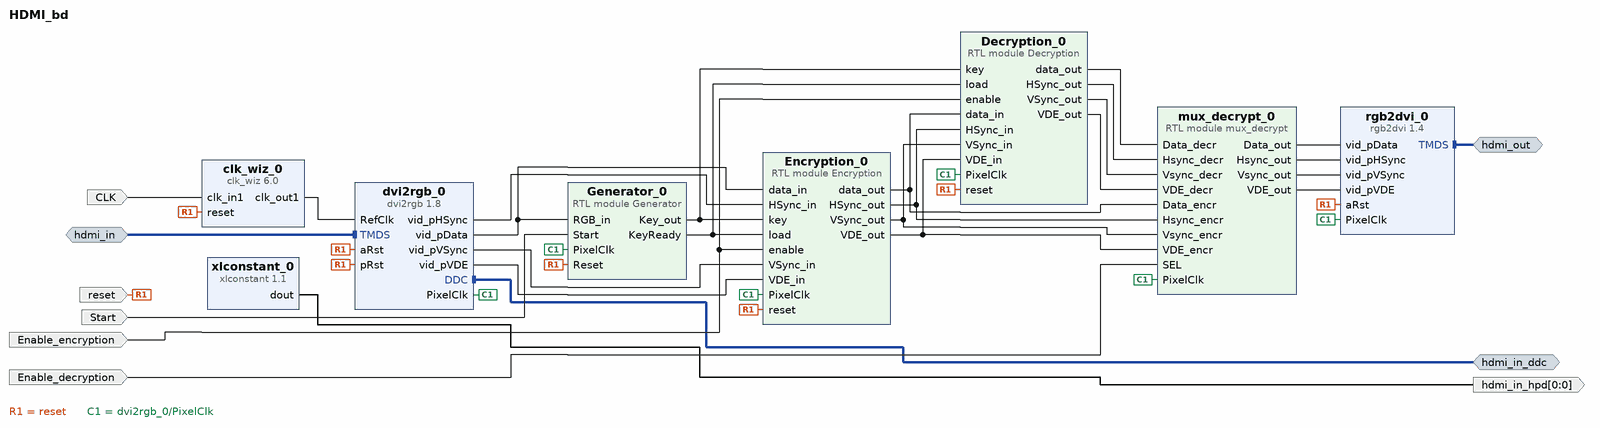
[diagram p0: block diagram of the top level]
# Vivado block design HDMI_bd, xc7z020clg400-1, Vivado 2018.3
create_bd_design HDMI_bd

create_bd_intf_port -mode Slave -vlnv digilentinc.com:interface:tmds_rtl:1.0 hdmi_in
create_bd_intf_port -mode Master -vlnv xilinx.com:interface:iic_rtl:1.0 hdmi_in_ddc
create_bd_intf_port -mode Master -vlnv digilentinc.com:interface:tmds_rtl:1.0 hdmi_out
create_bd_port -dir I -type clk CLK
set_property -dict {CONFIG.FREQ_HZ 125000000} [get_bd_ports CLK]
create_bd_port -dir I -type rst reset
set_property -dict {CONFIG.POLARITY ACTIVE_HIGH} [get_bd_ports reset]
create_bd_port -dir O -from 0 -to 0 hdmi_in_hpd
create_bd_port -dir I Start
create_bd_port -dir I Enable_encryption
create_bd_port -dir I Enable_decryption

create_bd_cell -type ip -vlnv digilentinc.com:ip:dvi2rgb:1.8 dvi2rgb_0
create_bd_cell -type ip -vlnv digilentinc.com:ip:rgb2dvi:1.4 rgb2dvi_0
set_property -dict {CONFIG.kClkPrimitive MMCM CONFIG.kClkRange 3} [get_bd_cells rgb2dvi_0]
create_bd_cell -type ip -vlnv xilinx.com:ip:clk_wiz:6.0 clk_wiz_0
set_property -dict [list \
  CONFIG.CLKIN1_JITTER_PS 80.0 \
  CONFIG.CLKOUT1_DRIVES BUFG \
  CONFIG.CLKOUT1_JITTER 109.241 \
  CONFIG.CLKOUT1_PHASE_ERROR 96.948 \
  CONFIG.CLKOUT1_REQUESTED_OUT_FREQ 200.000 \
  CONFIG.CLKOUT2_DRIVES BUFG \
  CONFIG.CLKOUT3_DRIVES BUFG \
  CONFIG.CLKOUT4_DRIVES BUFG \
  CONFIG.CLKOUT5_DRIVES BUFG \
  CONFIG.CLKOUT6_DRIVES BUFG \
  CONFIG.CLKOUT7_DRIVES BUFG \
  CONFIG.MMCM_CLKFBOUT_MULT_F 8 \
  CONFIG.MMCM_CLKIN1_PERIOD 8.000 \
  CONFIG.MMCM_CLKIN2_PERIOD 10.0 \
  CONFIG.MMCM_CLKOUT0_DIVIDE_F 5 \
  CONFIG.MMCM_COMPENSATION ZHOLD \
  CONFIG.MMCM_DIVCLK_DIVIDE 1 \
  CONFIG.PRIMITIVE PLL \
  CONFIG.PRIM_IN_FREQ 125.000 \
] [get_bd_cells clk_wiz_0]
create_bd_cell -type ip -vlnv xilinx.com:ip:xlconstant:1.1 xlconstant_0
create_bd_cell -type module -reference Generator Generator_0
create_bd_cell -type module -reference Encryption Encryption_0
create_bd_cell -type module -reference mux_decrypt mux_decrypt_0
create_bd_cell -type module -reference Decryption Decryption_0

# ---- connections ----

connect_bd_intf_net [get_bd_intf_ports hdmi_in] [get_bd_intf_pins dvi2rgb_0/TMDS]
connect_bd_intf_net [get_bd_intf_ports hdmi_out] [get_bd_intf_pins rgb2dvi_0/TMDS]
connect_bd_intf_net [get_bd_intf_ports hdmi_in_ddc] [get_bd_intf_pins dvi2rgb_0/DDC]
connect_bd_net [get_bd_ports CLK] [get_bd_pins clk_wiz_0/clk_in1]
connect_bd_net [get_bd_ports reset] \
  [get_bd_pins dvi2rgb_0/aRst] [get_bd_pins dvi2rgb_0/pRst] [get_bd_pins rgb2dvi_0/aRst] [get_bd_pins clk_wiz_0/reset] \
  [get_bd_pins Generator_0/Reset] [get_bd_pins Encryption_0/reset] [get_bd_pins Decryption_0/reset]
connect_bd_net [get_bd_pins clk_wiz_0/clk_out1] [get_bd_pins dvi2rgb_0/RefClk]
connect_bd_net [get_bd_pins dvi2rgb_0/PixelClk] \
  [get_bd_pins rgb2dvi_0/PixelClk] [get_bd_pins Generator_0/PixelClk] [get_bd_pins Encryption_0/PixelClk] \
  [get_bd_pins mux_decrypt_0/PixelClk] [get_bd_pins Decryption_0/PixelClk]
connect_bd_net [get_bd_pins xlconstant_0/dout] [get_bd_ports hdmi_in_hpd]
connect_bd_net [get_bd_pins Generator_0/Key_out] [get_bd_pins Encryption_0/key] [get_bd_pins Decryption_0/key]
connect_bd_net [get_bd_pins Generator_0/KeyReady] [get_bd_pins Encryption_0/load] [get_bd_pins Decryption_0/load]
connect_bd_net [get_bd_ports Start] [get_bd_pins Generator_0/Start]
connect_bd_net [get_bd_ports Enable_encryption] [get_bd_pins Encryption_0/enable] [get_bd_pins Decryption_0/enable]
connect_bd_net [get_bd_pins dvi2rgb_0/vid_pData] [get_bd_pins Generator_0/RGB_in] [get_bd_pins Encryption_0/data_in]
connect_bd_net [get_bd_pins dvi2rgb_0/vid_pHSync] [get_bd_pins Encryption_0/HSync_in]
connect_bd_net [get_bd_pins dvi2rgb_0/vid_pVSync] [get_bd_pins Encryption_0/VSync_in]
connect_bd_net [get_bd_pins dvi2rgb_0/vid_pVDE] [get_bd_pins Encryption_0/VDE_in]
connect_bd_net [get_bd_pins Decryption_0/data_out] [get_bd_pins mux_decrypt_0/Data_decr]
connect_bd_net [get_bd_pins Decryption_0/HSync_out] [get_bd_pins mux_decrypt_0/Hsync_decr]
connect_bd_net [get_bd_pins Decryption_0/VSync_out] [get_bd_pins mux_decrypt_0/Vsync_decr]
connect_bd_net [get_bd_pins Decryption_0/VDE_out] [get_bd_pins mux_decrypt_0/VDE_decr]
connect_bd_net [get_bd_pins Encryption_0/data_out] [get_bd_pins mux_decrypt_0/Data_encr] [get_bd_pins Decryption_0/data_in]
connect_bd_net [get_bd_pins Encryption_0/HSync_out] [get_bd_pins mux_decrypt_0/Hsync_encr] [get_bd_pins Decryption_0/HSync_in]
connect_bd_net [get_bd_pins Encryption_0/VSync_out] [get_bd_pins mux_decrypt_0/Vsync_encr] [get_bd_pins Decryption_0/VSync_in]
connect_bd_net [get_bd_pins Encryption_0/VDE_out] [get_bd_pins mux_decrypt_0/VDE_encr] [get_bd_pins Decryption_0/VDE_in]
connect_bd_net [get_bd_pins mux_decrypt_0/Data_out] [get_bd_pins rgb2dvi_0/vid_pData]
connect_bd_net [get_bd_pins mux_decrypt_0/Hsync_out] [get_bd_pins rgb2dvi_0/vid_pHSync]
connect_bd_net [get_bd_pins mux_decrypt_0/Vsync_out] [get_bd_pins rgb2dvi_0/vid_pVSync]
connect_bd_net [get_bd_pins mux_decrypt_0/VDE_out] [get_bd_pins rgb2dvi_0/vid_pVDE]
connect_bd_net [get_bd_ports Enable_decryption] [get_bd_pins mux_decrypt_0/SEL]

validate_bd_design
save_bd_design
